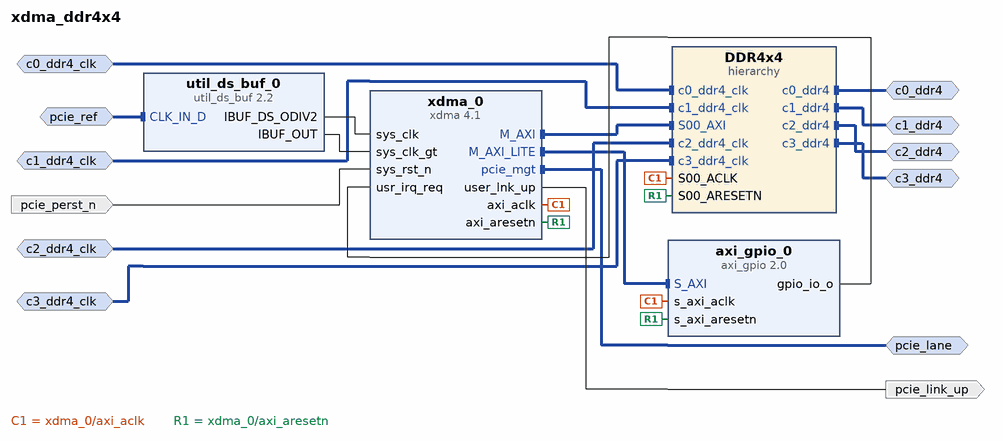
[diagram p0: block diagram of the top level]
# Vivado block design xdma_ddr4x4, xcvu13p-fhgb2104-2L-e, Vivado 2022.2
create_bd_design xdma_ddr4x4

create_bd_intf_port -mode Slave -vlnv xilinx.com:interface:diff_clock_rtl:1.0 pcie_ref
create_bd_intf_port -mode Master -vlnv xilinx.com:interface:pcie_7x_mgt_rtl:1.0 pcie_lane
create_bd_intf_port -mode Master -vlnv xilinx.com:interface:ddr4_rtl:1.0 c3_ddr4
create_bd_intf_port -mode Master -vlnv xilinx.com:interface:ddr4_rtl:1.0 c2_ddr4
create_bd_intf_port -mode Master -vlnv xilinx.com:interface:ddr4_rtl:1.0 c0_ddr4
create_bd_intf_port -mode Master -vlnv xilinx.com:interface:ddr4_rtl:1.0 c1_ddr4
create_bd_intf_port -mode Slave -vlnv xilinx.com:interface:diff_clock_rtl:1.0 c1_ddr4_clk
set_property -dict {CONFIG.FREQ_HZ 400000000} [get_bd_intf_ports c1_ddr4_clk]
create_bd_intf_port -mode Slave -vlnv xilinx.com:interface:diff_clock_rtl:1.0 c2_ddr4_clk
set_property -dict {CONFIG.FREQ_HZ 400000000} [get_bd_intf_ports c2_ddr4_clk]
create_bd_intf_port -mode Slave -vlnv xilinx.com:interface:diff_clock_rtl:1.0 c3_ddr4_clk
set_property -dict {CONFIG.FREQ_HZ 400000000} [get_bd_intf_ports c3_ddr4_clk]
create_bd_intf_port -mode Slave -vlnv xilinx.com:interface:diff_clock_rtl:1.0 c0_ddr4_clk
set_property -dict {CONFIG.FREQ_HZ 400000000} [get_bd_intf_ports c0_ddr4_clk]
create_bd_port -dir I -type rst pcie_perst_n
create_bd_port -dir O pcie_link_up

create_bd_cell -type ip -vlnv xilinx.com:ip:xdma:4.1 xdma_0
set_property -dict [list \
  CONFIG.axilite_master_en true \
  CONFIG.pl_link_cap_max_link_speed 8.0_GT/s \
  CONFIG.pl_link_cap_max_link_width X16 \
] [get_bd_cells xdma_0]
create_bd_cell -type ip -vlnv xilinx.com:ip:util_ds_buf:2.2 util_ds_buf_0
set_property -dict {CONFIG.C_BUF_TYPE IBUFDSGTE} [get_bd_cells util_ds_buf_0]
create_bd_cell -type hier DDR4x4
create_bd_cell -type ip -vlnv xilinx.com:ip:axi_gpio:2.0 axi_gpio_0
set_property -dict {CONFIG.C_ALL_OUTPUTS 1 CONFIG.C_GPIO_WIDTH 1} [get_bd_cells axi_gpio_0]

# ---- hierarchy /DDR4x4 ----
current_bd_instance /DDR4x4
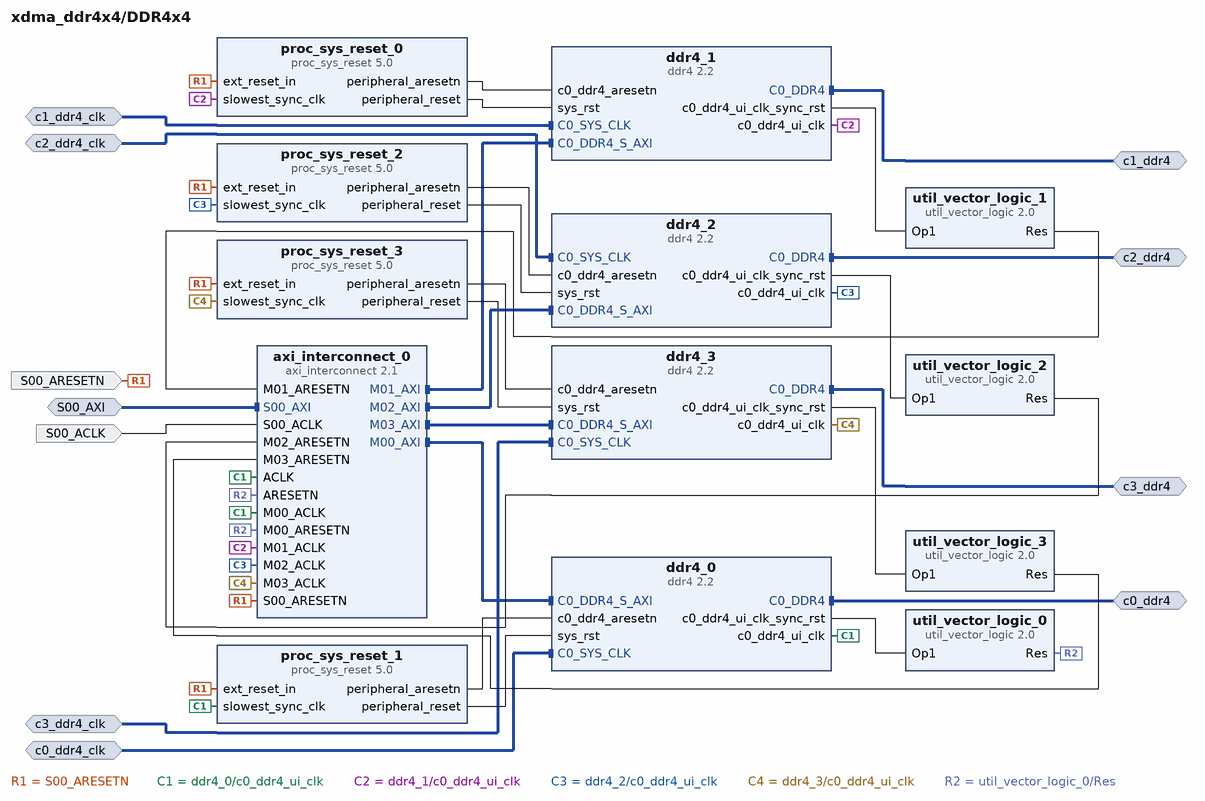
[diagram p1: block diagram inside /DDR4x4]
create_bd_intf_pin -mode Slave -vlnv xilinx.com:interface:aximm_rtl:1.0 S00_AXI
create_bd_intf_pin -mode Master -vlnv xilinx.com:interface:ddr4_rtl:1.0 c3_ddr4
create_bd_intf_pin -mode Master -vlnv xilinx.com:interface:ddr4_rtl:1.0 c2_ddr4
create_bd_intf_pin -mode Master -vlnv xilinx.com:interface:ddr4_rtl:1.0 c0_ddr4
create_bd_intf_pin -mode Master -vlnv xilinx.com:interface:ddr4_rtl:1.0 c1_ddr4
create_bd_intf_pin -mode Slave -vlnv xilinx.com:interface:diff_clock_rtl:1.0 c1_ddr4_clk
create_bd_intf_pin -mode Slave -vlnv xilinx.com:interface:diff_clock_rtl:1.0 c2_ddr4_clk
create_bd_intf_pin -mode Slave -vlnv xilinx.com:interface:diff_clock_rtl:1.0 c3_ddr4_clk
create_bd_intf_pin -mode Slave -vlnv xilinx.com:interface:diff_clock_rtl:1.0 c0_ddr4_clk
create_bd_pin -dir I S00_ACLK
create_bd_pin -dir I S00_ARESETN

create_bd_cell -type ip -vlnv xilinx.com:ip:ddr4:2.2 ddr4_1
set_property -dict [list \
  CONFIG.C0.DDR4_AxiArbitrationScheme RD_PRI_REG \
  CONFIG.C0.DDR4_AxiDataWidth 512 \
  CONFIG.C0.DDR4_AxiIDWidth 8 \
  CONFIG.C0.DDR4_CasLatency 16 \
  CONFIG.C0.DDR4_CasWriteLatency 12 \
  CONFIG.C0.DDR4_DataMask DM_NO_DBI \
  CONFIG.C0.DDR4_DataWidth 64 \
  CONFIG.C0.DDR4_InputClockPeriod 2499 \
  CONFIG.C0.DDR4_Mem_Add_Map ROW_COLUMN_BANK \
  CONFIG.C0.DDR4_MemoryPart MT40A512M16HA-083E \
  CONFIG.C0.DDR4_MemoryType Components \
  CONFIG.C0.DDR4_MemoryVoltage 1.2V \
  CONFIG.C0.DDR4_Ordering Normal \
  CONFIG.C0.DDR4_PhyClockRatio 4:1 \
  CONFIG.C0.DDR4_Slot Single \
  CONFIG.C0.DDR4_TimePeriod 833 \
] [get_bd_cells ddr4_1]
create_bd_cell -type ip -vlnv xilinx.com:ip:ddr4:2.2 ddr4_2
set_property -dict [list \
  CONFIG.C0.DDR4_AxiArbitrationScheme RD_PRI_REG \
  CONFIG.C0.DDR4_AxiDataWidth 512 \
  CONFIG.C0.DDR4_AxiIDWidth 8 \
  CONFIG.C0.DDR4_CasLatency 16 \
  CONFIG.C0.DDR4_CasWriteLatency 12 \
  CONFIG.C0.DDR4_DataMask DM_NO_DBI \
  CONFIG.C0.DDR4_DataWidth 64 \
  CONFIG.C0.DDR4_InputClockPeriod 2499 \
  CONFIG.C0.DDR4_Mem_Add_Map ROW_COLUMN_BANK \
  CONFIG.C0.DDR4_MemoryPart MT40A512M16HA-083E \
  CONFIG.C0.DDR4_MemoryType Components \
  CONFIG.C0.DDR4_MemoryVoltage 1.2V \
  CONFIG.C0.DDR4_Ordering Normal \
  CONFIG.C0.DDR4_PhyClockRatio 4:1 \
  CONFIG.C0.DDR4_Slot Single \
  CONFIG.C0.DDR4_TimePeriod 833 \
] [get_bd_cells ddr4_2]
create_bd_cell -type ip -vlnv xilinx.com:ip:ddr4:2.2 ddr4_3
set_property -dict [list \
  CONFIG.C0.DDR4_AxiArbitrationScheme RD_PRI_REG \
  CONFIG.C0.DDR4_AxiDataWidth 512 \
  CONFIG.C0.DDR4_AxiIDWidth 8 \
  CONFIG.C0.DDR4_CasLatency 16 \
  CONFIG.C0.DDR4_CasWriteLatency 12 \
  CONFIG.C0.DDR4_DataMask DM_NO_DBI \
  CONFIG.C0.DDR4_DataWidth 64 \
  CONFIG.C0.DDR4_InputClockPeriod 2499 \
  CONFIG.C0.DDR4_Mem_Add_Map ROW_COLUMN_BANK \
  CONFIG.C0.DDR4_MemoryPart MT40A512M16HA-083E \
  CONFIG.C0.DDR4_MemoryType Components \
  CONFIG.C0.DDR4_MemoryVoltage 1.2V \
  CONFIG.C0.DDR4_Ordering Normal \
  CONFIG.C0.DDR4_PhyClockRatio 4:1 \
  CONFIG.C0.DDR4_Slot Single \
  CONFIG.C0.DDR4_TimePeriod 833 \
] [get_bd_cells ddr4_3]
create_bd_cell -type ip -vlnv xilinx.com:ip:ddr4:2.2 ddr4_0
set_property -dict [list \
  CONFIG.C0.DDR4_AxiArbitrationScheme RD_PRI_REG \
  CONFIG.C0.DDR4_AxiDataWidth 512 \
  CONFIG.C0.DDR4_AxiIDWidth 8 \
  CONFIG.C0.DDR4_CasLatency 16 \
  CONFIG.C0.DDR4_CasWriteLatency 12 \
  CONFIG.C0.DDR4_DataMask DM_NO_DBI \
  CONFIG.C0.DDR4_DataWidth 64 \
  CONFIG.C0.DDR4_InputClockPeriod 2499 \
  CONFIG.C0.DDR4_Mem_Add_Map ROW_COLUMN_BANK \
  CONFIG.C0.DDR4_MemoryPart MT40A512M16HA-083E \
  CONFIG.C0.DDR4_MemoryType Components \
  CONFIG.C0.DDR4_MemoryVoltage 1.2V \
  CONFIG.C0.DDR4_Ordering Normal \
  CONFIG.C0.DDR4_PhyClockRatio 4:1 \
  CONFIG.C0.DDR4_Slot Single \
  CONFIG.C0.DDR4_TimePeriod 833 \
] [get_bd_cells ddr4_0]
create_bd_cell -type ip -vlnv xilinx.com:ip:axi_interconnect:2.1 axi_interconnect_0
set_property -dict {CONFIG.NUM_MI 4} [get_bd_cells axi_interconnect_0]
create_bd_cell -type ip -vlnv xilinx.com:ip:util_vector_logic:2.0 util_vector_logic_0
set_property -dict {CONFIG.C_OPERATION not CONFIG.C_SIZE 1} [get_bd_cells util_vector_logic_0]
create_bd_cell -type ip -vlnv xilinx.com:ip:proc_sys_reset:5.0 proc_sys_reset_0
create_bd_cell -type ip -vlnv xilinx.com:ip:util_vector_logic:2.0 util_vector_logic_1
set_property -dict {CONFIG.C_OPERATION not CONFIG.C_SIZE 1} [get_bd_cells util_vector_logic_1]
create_bd_cell -type ip -vlnv xilinx.com:ip:util_vector_logic:2.0 util_vector_logic_2
set_property -dict {CONFIG.C_OPERATION not CONFIG.C_SIZE 1} [get_bd_cells util_vector_logic_2]
create_bd_cell -type ip -vlnv xilinx.com:ip:util_vector_logic:2.0 util_vector_logic_3
set_property -dict {CONFIG.C_OPERATION not CONFIG.C_SIZE 1} [get_bd_cells util_vector_logic_3]
create_bd_cell -type ip -vlnv xilinx.com:ip:proc_sys_reset:5.0 proc_sys_reset_1
create_bd_cell -type ip -vlnv xilinx.com:ip:proc_sys_reset:5.0 proc_sys_reset_2
create_bd_cell -type ip -vlnv xilinx.com:ip:proc_sys_reset:5.0 proc_sys_reset_3

# ---- connections ----

current_bd_instance /DDR4x4
connect_bd_intf_net [get_bd_intf_pins axi_interconnect_0/M00_AXI] [get_bd_intf_pins ddr4_0/C0_DDR4_S_AXI]
connect_bd_intf_net [get_bd_intf_pins axi_interconnect_0/M01_AXI] [get_bd_intf_pins ddr4_1/C0_DDR4_S_AXI]
connect_bd_intf_net [get_bd_intf_pins axi_interconnect_0/M02_AXI] [get_bd_intf_pins ddr4_2/C0_DDR4_S_AXI]
connect_bd_intf_net [get_bd_intf_pins axi_interconnect_0/M03_AXI] [get_bd_intf_pins ddr4_3/C0_DDR4_S_AXI]
connect_bd_intf_net [get_bd_intf_pins c0_ddr4_clk] [get_bd_intf_pins ddr4_0/C0_SYS_CLK]
connect_bd_intf_net [get_bd_intf_pins c1_ddr4_clk] [get_bd_intf_pins ddr4_1/C0_SYS_CLK]
connect_bd_intf_net [get_bd_intf_pins c2_ddr4_clk] [get_bd_intf_pins ddr4_2/C0_SYS_CLK]
connect_bd_intf_net [get_bd_intf_pins c3_ddr4_clk] [get_bd_intf_pins ddr4_3/C0_SYS_CLK]
connect_bd_intf_net [get_bd_intf_pins c0_ddr4] [get_bd_intf_pins ddr4_0/C0_DDR4]
connect_bd_intf_net [get_bd_intf_pins c1_ddr4] [get_bd_intf_pins ddr4_1/C0_DDR4]
connect_bd_intf_net [get_bd_intf_pins c2_ddr4] [get_bd_intf_pins ddr4_2/C0_DDR4]
connect_bd_intf_net [get_bd_intf_pins c3_ddr4] [get_bd_intf_pins ddr4_3/C0_DDR4]
connect_bd_intf_net -intf_net xdma_0_M_AXI [get_bd_intf_pins S00_AXI] [get_bd_intf_pins axi_interconnect_0/S00_AXI]
connect_bd_net [get_bd_pins S00_ACLK] [get_bd_pins axi_interconnect_0/S00_ACLK]
connect_bd_net [get_bd_pins S00_ARESETN] \
  [get_bd_pins axi_interconnect_0/S00_ARESETN] [get_bd_pins proc_sys_reset_0/ext_reset_in] \
  [get_bd_pins proc_sys_reset_3/ext_reset_in] [get_bd_pins proc_sys_reset_2/ext_reset_in] \
  [get_bd_pins proc_sys_reset_1/ext_reset_in]
connect_bd_net [get_bd_pins ddr4_0/c0_ddr4_ui_clk] \
  [get_bd_pins axi_interconnect_0/M00_ACLK] [get_bd_pins axi_interconnect_0/ACLK] \
  [get_bd_pins proc_sys_reset_1/slowest_sync_clk]
connect_bd_net [get_bd_pins ddr4_0/c0_ddr4_ui_clk_sync_rst] [get_bd_pins util_vector_logic_0/Op1]
connect_bd_net [get_bd_pins ddr4_1/c0_ddr4_ui_clk] [get_bd_pins axi_interconnect_0/M01_ACLK] [get_bd_pins proc_sys_reset_0/slowest_sync_clk]
connect_bd_net [get_bd_pins ddr4_1/c0_ddr4_ui_clk_sync_rst] [get_bd_pins util_vector_logic_1/Op1]
connect_bd_net [get_bd_pins ddr4_2/c0_ddr4_ui_clk] [get_bd_pins axi_interconnect_0/M02_ACLK] [get_bd_pins proc_sys_reset_2/slowest_sync_clk]
connect_bd_net [get_bd_pins ddr4_2/c0_ddr4_ui_clk_sync_rst] [get_bd_pins util_vector_logic_2/Op1]
connect_bd_net [get_bd_pins ddr4_3/c0_ddr4_ui_clk] [get_bd_pins axi_interconnect_0/M03_ACLK] [get_bd_pins proc_sys_reset_3/slowest_sync_clk]
connect_bd_net [get_bd_pins ddr4_3/c0_ddr4_ui_clk_sync_rst] [get_bd_pins util_vector_logic_3/Op1]
connect_bd_net [get_bd_pins proc_sys_reset_0/peripheral_aresetn] [get_bd_pins ddr4_1/c0_ddr4_aresetn]
connect_bd_net [get_bd_pins proc_sys_reset_0/peripheral_reset] [get_bd_pins ddr4_1/sys_rst]
connect_bd_net [get_bd_pins proc_sys_reset_1/peripheral_aresetn] [get_bd_pins ddr4_0/c0_ddr4_aresetn]
connect_bd_net [get_bd_pins proc_sys_reset_1/peripheral_reset] [get_bd_pins ddr4_0/sys_rst]
connect_bd_net [get_bd_pins proc_sys_reset_2/peripheral_aresetn] [get_bd_pins ddr4_2/c0_ddr4_aresetn]
connect_bd_net [get_bd_pins proc_sys_reset_2/peripheral_reset] [get_bd_pins ddr4_2/sys_rst]
connect_bd_net [get_bd_pins proc_sys_reset_3/peripheral_aresetn] [get_bd_pins ddr4_3/c0_ddr4_aresetn]
connect_bd_net [get_bd_pins proc_sys_reset_3/peripheral_reset] [get_bd_pins ddr4_3/sys_rst]
connect_bd_net [get_bd_pins util_vector_logic_0/Res] [get_bd_pins axi_interconnect_0/M00_ARESETN] [get_bd_pins axi_interconnect_0/ARESETN]
connect_bd_net [get_bd_pins util_vector_logic_1/Res] [get_bd_pins axi_interconnect_0/M01_ARESETN]
connect_bd_net [get_bd_pins util_vector_logic_2/Res] [get_bd_pins axi_interconnect_0/M02_ARESETN]
connect_bd_net [get_bd_pins util_vector_logic_3/Res] [get_bd_pins axi_interconnect_0/M03_ARESETN]

current_bd_instance /
connect_bd_intf_net [get_bd_intf_ports c0_ddr4] [get_bd_intf_pins DDR4x4/c0_ddr4]
connect_bd_intf_net [get_bd_intf_ports c1_ddr4] [get_bd_intf_pins DDR4x4/c1_ddr4]
connect_bd_intf_net [get_bd_intf_ports c2_ddr4] [get_bd_intf_pins DDR4x4/c2_ddr4]
connect_bd_intf_net [get_bd_intf_ports c3_ddr4] [get_bd_intf_pins DDR4x4/c3_ddr4]
connect_bd_intf_net [get_bd_intf_ports c0_ddr4_clk] [get_bd_intf_pins DDR4x4/c0_ddr4_clk]
connect_bd_intf_net [get_bd_intf_ports c1_ddr4_clk] [get_bd_intf_pins DDR4x4/c1_ddr4_clk]
connect_bd_intf_net [get_bd_intf_ports c2_ddr4_clk] [get_bd_intf_pins DDR4x4/c2_ddr4_clk]
connect_bd_intf_net [get_bd_intf_ports c3_ddr4_clk] [get_bd_intf_pins DDR4x4/c3_ddr4_clk]
connect_bd_intf_net [get_bd_intf_ports pcie_ref] [get_bd_intf_pins util_ds_buf_0/CLK_IN_D]
connect_bd_intf_net [get_bd_intf_pins xdma_0/M_AXI] [get_bd_intf_pins DDR4x4/S00_AXI]
connect_bd_intf_net [get_bd_intf_pins xdma_0/M_AXI_LITE] [get_bd_intf_pins axi_gpio_0/S_AXI]
connect_bd_intf_net [get_bd_intf_ports pcie_lane] [get_bd_intf_pins xdma_0/pcie_mgt]
connect_bd_net [get_bd_pins axi_gpio_0/gpio_io_o] [get_bd_pins xdma_0/usr_irq_req]
connect_bd_net [get_bd_ports pcie_perst_n] [get_bd_pins xdma_0/sys_rst_n]
connect_bd_net [get_bd_pins util_ds_buf_0/IBUF_DS_ODIV2] [get_bd_pins xdma_0/sys_clk]
connect_bd_net [get_bd_pins util_ds_buf_0/IBUF_OUT] [get_bd_pins xdma_0/sys_clk_gt]
connect_bd_net [get_bd_pins xdma_0/axi_aclk] [get_bd_pins DDR4x4/S00_ACLK] [get_bd_pins axi_gpio_0/s_axi_aclk]
connect_bd_net [get_bd_pins xdma_0/axi_aresetn] [get_bd_pins DDR4x4/S00_ARESETN] [get_bd_pins axi_gpio_0/s_axi_aresetn]
connect_bd_net [get_bd_pins xdma_0/user_lnk_up] [get_bd_ports pcie_link_up]

# ---- address map ----
assign_bd_address -offset 0x0000000000000000 -range 4G -target_address_space [get_bd_addr_spaces xdma_0/M_AXI] [get_bd_addr_segs DDR4x4/ddr4_0/C0_DDR4_MEMORY_MAP/C0_DDR4_ADDRESS_BLOCK]
assign_bd_address -offset 0x0000000100000000 -range 4G -target_address_space [get_bd_addr_spaces xdma_0/M_AXI] [get_bd_addr_segs DDR4x4/ddr4_1/C0_DDR4_MEMORY_MAP/C0_DDR4_ADDRESS_BLOCK]
assign_bd_address -offset 0x0000000200000000 -range 4G -target_address_space [get_bd_addr_spaces xdma_0/M_AXI] [get_bd_addr_segs DDR4x4/ddr4_2/C0_DDR4_MEMORY_MAP/C0_DDR4_ADDRESS_BLOCK]
assign_bd_address -offset 0x0000000300000000 -range 4G -target_address_space [get_bd_addr_spaces xdma_0/M_AXI] [get_bd_addr_segs DDR4x4/ddr4_3/C0_DDR4_MEMORY_MAP/C0_DDR4_ADDRESS_BLOCK]
assign_bd_address -offset 0x00000000 -range 64K -target_address_space [get_bd_addr_spaces xdma_0/M_AXI_LITE] [get_bd_addr_segs axi_gpio_0/S_AXI/Reg]

validate_bd_design
save_bd_design
